# Altium project WiWi_SDR.PrjPcb (part 2 of 5)

## Sheet 06-SX1276.SchDoc
size B; SheetNumber: 6; SheetTotal: 19
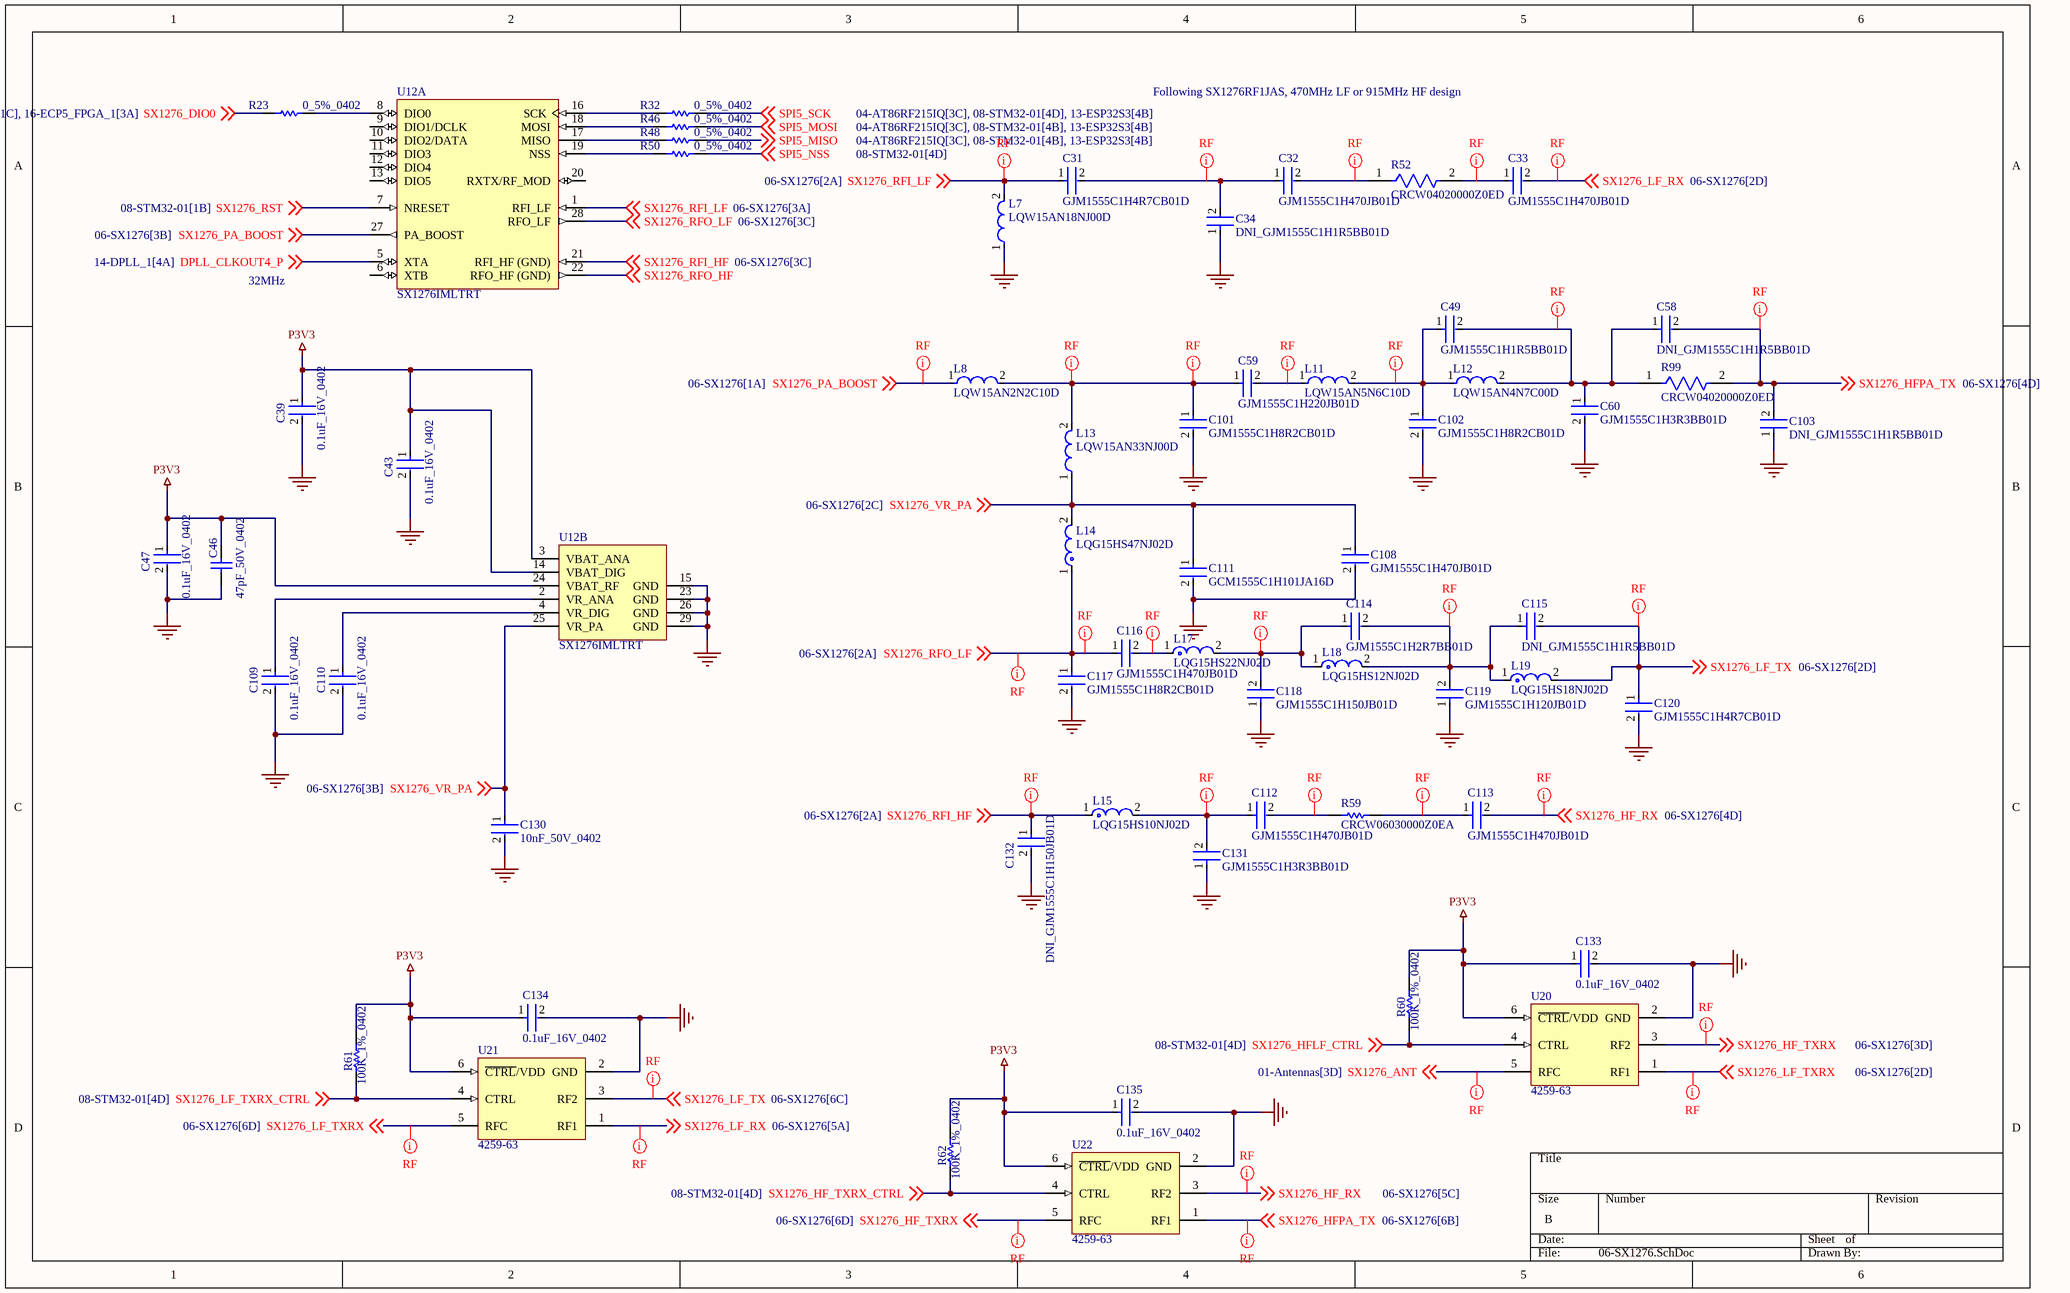
[diagram p4: 06-SX1276.SchDoc]

### Parts
C31  GJM1555C1H4R7CB01D  [FP-GJM155-0_05-IPC_B]
C32  GJM1555C1H470JB01D  [FP-GJM155-0_05-MFG]
C33  GJM1555C1H470JB01D  [FP-GJM155-0_05-MFG]
C34  DNI_GJM1555C1H1R5BB01D  [FP-GJM155-0_05-IPC_C]  (no BOM)
C39  0.1uF_16V_0402  [FP-C0402-BB-MFG]
C43  0.1uF_16V_0402  [FP-C0402-BB-MFG]
C46  47pF_50V_0402  [CAPC1005X55X25LL05T10]
C47  0.1uF_16V_0402  [FP-C0402-BB-MFG]
C49  GJM1555C1H1R5BB01D  [FP-GJM155-0_05-IPC_C]
C58  DNI_GJM1555C1H1R5BB01D  [FP-GJM155-0_05-IPC_C]  (no BOM)
C59  GJM1555C1H220JB01D  [FP-GJM155-0_05-IPC_C]
C60  GJM1555C1H3R3BB01D  [FP-GJM155-0_05-IPC_C]
C101  GJM1555C1H8R2CB01D  [FP-GJM155-0_05-IPC_C]
C102  GJM1555C1H8R2CB01D  [FP-GJM155-0_05-IPC_C]
C103  DNI_GJM1555C1H1R5BB01D  [FP-GJM155-0_05-IPC_C]  (no BOM)
C108  GJM1555C1H470JB01D  [FP-GJM155-0_05-MFG]
C109  0.1uF_16V_0402  [FP-C0402-BB-MFG]
C110  0.1uF_16V_0402  [FP-C0402-BB-MFG]
C111  GCM1555C1H101JA16D  [FP-GCM155-0_05-IPC_C]
C112  GJM1555C1H470JB01D  [FP-GJM155-0_05-MFG]
C113  GJM1555C1H470JB01D  [FP-GJM155-0_05-MFG]
C114  GJM1555C1H2R7BB01D  [FP-GJM155-0_05-IPC_A]
C115  DNI_GJM1555C1H1R5BB01D  [FP-GJM155-0_05-IPC_C]  (no BOM)
C116  GJM1555C1H470JB01D  [FP-GJM155-0_05-MFG]
C117  GJM1555C1H8R2CB01D  [FP-GJM155-0_05-IPC_C]
C118  GJM1555C1H150JB01D  [FP-GJM155-0_05-IPC_A]
C119  GJM1555C1H120JB01D  [FP-GJM155-0_05-IPC_A]
C120  GJM1555C1H4R7CB01D  [FP-GJM155-0_05-IPC_B]
C130  10nF_50V_0402  [FP-CL165-IPC_C]
C131  GJM1555C1H3R3BB01D  [FP-GJM155-0_05-IPC_C]
C132  DNI_GJM1555C1H150JB01D  [FP-GJM155-0_05-IPC_A]  (no BOM)
C133  0.1uF_16V_0402  [FP-C0402-BB-MFG]
C134  0.1uF_16V_0402  [FP-C0402-BB-MFG]
C135  0.1uF_16V_0402  [FP-C0402-BB-MFG]
L7  LQW15AN18NJ00D  [FP-LQW15AN_00-W0_6-0_1-MFG]
L8  LQW15AN2N2C10D  [FP-LQW15AN_00-W0_6-0_1-MFG]
L11  LQW15AN5N6C10D  [FP-LQW15AN_00-W0_6-0_1-MFG]
L12  LQW15AN4N7C00D  [FP-LQW15AN_00-W0_6-0_1-MFG]
L13  LQW15AN33NJ00D  [FP-LQW15AN_00-W0_5-0_1-MFG]
L14  LQG15HS47NJ02D  [FP-LQG15HH_02-IPC_B]
L15  LQG15HS10NJ02D  [FP-LQG15HH_02-IPC_A]
L17  LQG15HS22NJ02D  [FP-LQG15HH_02-MFG]
L18  LQG15HS12NJ02D  [FP-LQG15HH_02-IPC_A]
L19  LQG15HS18NJ02D  [FP-LQG15HH_02-MFG]
R23  0_5%_0402  [RESC1005X40X25NL05T10]
R32  0_5%_0402  [RESC1005X40X25NL05T10]
R46  0_5%_0402  [RESC1005X40X25NL05T10]
R48  0_5%_0402  [RESC1005X40X25NL05T10]
R50  0_5%_0402  [RESC1005X40X25NL05T10]
R52  CRCW04020000Z0ED  [FP-CRCW0402-e3-IPC_C]
R59  CRCW06030000Z0EA  [RESC1609X50X30NL8T20]
R60  100K_1%_0402  [RESC1005X40X25ML05T10]
R61  100K_1%_0402  [RESC1005X40X25ML05T10]
R62  100K_1%_0402  [RESC1005X40X25ML05T10]
R99  CRCW04020000Z0ED  [FP-CRCW0402-e3-IPC_C]
U12  SX1276IMLTRT  [SMTC-QFN-28_V]  (parts A,B of 2)
U20  4259-63  [PERE-SC-70-6_M]
U21  4259-63  [PERE-SC-70-6_M]
U22  4259-63  [PERE-SC-70-6_M]

### Nets
GND: C34.1 C39.2 C43.2 C46.1 C47.2 C60.2 C101.2 C102.2 C103.1 C108.2 C109.2 C110.2 C111.2 C117.2 C118.1 C119.1 C120.2 C130.2 C131.1 C132.2 C133.2 C134.2 C135.2 L7.1 U12.15(GND) U12.23(GND) U12.26(GND) U12.29(GND) U20.2(GND) U21.2(GND) U22.2(GND)
P3V3: C39.1 C43.1 C46.2 C47.1 C133.1 C134.1 C135.1 R60.2 R61.2 R62.2 U12.3(VBAT_ANA) U12.14(VBAT_DIG) U12.24(VBAT_RF) U20.6(~{CTRL}/VDD) U21.6(~{CTRL}/VDD) U22.6(~{CTRL}/VDD)
DPLL_CLKOUT4_P: U12.5(XTA) ; off-sheet DPLL_CLKOUT4_P
SPI5_MISO: R48.2 ; off-sheet SPI5_MISO
SPI5_MOSI: R46.2 ; off-sheet SPI5_MOSI
SPI5_NSS: R50.2 ; off-sheet SPI5_NSS
SPI5_SCK: R32.2 ; off-sheet SPI5_SCK
SX1276_ANT: U20.5(RFC) ; off-sheet SX1276_ANT
SX1276_DIO0: R23.1 ; off-sheet SX1276_DIO0
SX1276_HF_RX: C113.2 U22.3(RF2) ; off-sheet SX1276_HF_RX
SX1276_HF_TXRX: U20.3(RF2) U22.5(RFC) ; off-sheet SX1276_HF_TXRX
SX1276_HF_TXRX_CTRL: R62.1 U22.4(CTRL) ; off-sheet SX1276_HF_TXRX_CTRL
SX1276_HFLF_CTRL: R60.1 U20.4(CTRL) ; off-sheet SX1276_HFLF_CTRL
SX1276_HFPA_TX: C58.2 C103.2 R99.2 U22.1(RF1) ; off-sheet SX1276_HFPA_TX
SX1276_LF_RX: C33.2 U21.1(RF1) ; off-sheet SX1276_LF_RX
SX1276_LF_TX: C115.2 C120.1 L19.2 U21.3(RF2) ; off-sheet SX1276_LF_TX
SX1276_LF_TXRX: U20.1(RF1) U21.5(RFC) ; off-sheet SX1276_LF_TXRX
SX1276_LF_TXRX_CTRL: R61.1 U21.4(CTRL) ; off-sheet SX1276_LF_TXRX_CTRL
SX1276_PA_BOOST: L8.1 U12.27(PA_BOOST) ; off-sheet SX1276_PA_BOOST
SX1276_RFI_HF: C132.1 L15.1 U12.21(RFI_HF_(GND)) ; off-sheet SX1276_RFI_HF
SX1276_RFI_LF: C31.1 L7.2 U12.1(RFI_LF) ; off-sheet SX1276_RFI_LF
SX1276_RFO_HF: U12.22(RFO_HF_(GND)) ; off-sheet SX1276_RFO_HF
SX1276_RFO_LF: C116.1 C117.1 L14.1 U12.28(RFO_LF) ; off-sheet SX1276_RFO_LF
SX1276_RST: U12.7(NRESET) ; off-sheet SX1276_RST
SX1276_VR_PA: C108.1 C111.1 C130.1 L13.1 L14.2 U12.25(VR_PA) ; off-sheet SX1276_VR_PA
NetC31_2: C31.2 C32.1 C34.2
NetC32_2: C32.2 R52.1
NetC33_1: C33.1 R52.2
NetC49_1: C49.1 C102.1 L11.2 L12.1
NetC49_2: C49.2 C58.1 C60.1 L12.2 R99.1
NetC59_1: C59.1 C101.1 L8.2 L13.2
NetC59_2: C59.2 L11.1
NetC109_1: C109.1 U12.2(VR_ANA)
NetC110_1: C110.1 U12.4(VR_DIG)
NetC112_1: C112.1 C131.2 L15.2
NetC112_2: C112.2 R59.1
NetC113_1: C113.1 R59.2
NetC114_1: C114.1 C118.2 L17.2 L18.1
NetC114_2: C114.2 C115.1 C119.2 L18.2 L19.1
NetC116_2: C116.2 L17.1
NetR23_2: R23.2 U12.8(DIO0)
NetR32_1: R32.1 U12.16(SCK)
NetR46_1: R46.1 U12.18(MOSI)
NetR48_1: R48.1 U12.17(MISO)
NetR50_1: R50.1 U12.19(NSS)

Not connected (* = marked no-connect by the designer): U12 6(XTB) 9(DIO1/DCLK) 10(DIO2/DATA) 11(DIO3) 12(DIO4) 13(DIO5) 20(RXTX/RF_MOD)

### Layout directives
net class RF: NetC31_2, NetC32_2, NetC33_1, NetC49_1, NetC49_2, NetC59_1, NetC59_2, NetC112_1, NetC112_2, NetC113_1, NetC114_1, NetC114_2, NetC116_2, SX1276_ANT, SX1276_HF_RX, SX1276_HF_TXRX, SX1276_HFPA_TX, SX1276_LF_RX, SX1276_LF_TX, SX1276_LF_TXRX, SX1276_PA_BOOST, SX1276_RFI_HF, SX1276_RFI_LF, SX1276_RFO_LF

### Notes on the sheet
- Following SX1276RF1JAS, 470MHz LF or 915MHz HF design
- 32MHz

### Library data of the parts
C31 C120 = CMP-2008-03859-2: Multi-Layer Ceramic Capacitor 4.7pF C0G  ±0.25pF 0402 Paper T/R; Voltage Rating (DC): 50V; Temperature Coefficient: 30ppm/°C; Case/Package: 0402; Packaging: Tape and Reel; Package Quantity: 10000; Depth: 0.5mm; REACH SVHC: No SVHC; Height: 0.5mm; Lead Free: Lead Free; Number of Pins: 2; Case Code (Imperial): 0402; Width: 0.02inch; Max Operating Temperature: 125°C; Capacitance: 4.7pF; Dielectric: C0G; Lead Pitch: 0.3mm; Voltage Rating: 50V; Min Operating Temperature: -55°C; Thickness: 0.022inch; Voltage: 50V; Radiation Hardening: No; Mount: Surface Mount; Termination: SMD/SMT; Case Code (Metric): 1005; Length: 1mm
C32 C33 C108 C112 C113 C116 = CMP-06035-013708-1: Multi-Layer Ceramic Capacitor 47pF C0G  ±5% 0402 Paper T/R; Voltage Rating (DC): 50V; Capacitance: 47pF; Tolerance: 5%; Dielectric: C0G; Thickness: 500um; Length: 1mm; Width: 500um
C34 C49 C58 C103 C115 = CMP-2008-03820-2: Multi-Layer Ceramic Capacitor 1.5pF C0G  ±0.1pF 0402 Paper T/R; Temperature Coefficient: 30ppm/°C; Voltage Rating: 50V; Depth: 0.5mm; Case Code (Imperial): 0402; Package Quantity: 10000; Length: 1mm; Number of Pins: 2; Max Operating Temperature: 125°C; Mount: Surface Mount; Construction: Flat; Thickness: 0.022inch; Series: GJM; Packaging: Tape and Reel; Radiation Hardening: No; REACH SVHC: No SVHC; Case/Package: 0402; Lead Free: Lead Free; Voltage Rating (DC): 50V; Min Operating Temperature: -55°C; Dielectric: C0G; Termination: SMD/SMT; Width: 0.5mm; Capacitance: 1.5pF; Lead Pitch: 0.3mm; Case Code (Metric): 1005; Voltage: 50V; Height: 0.5mm
C39 C43 C47 C109 C110 C133-C135 = CMP-1034-02068-3: CAP CER 0.1UF 16V 5% X7R 0402; Manufacturer: Kemet; Manufacturer Part Number: C0402C104J4RACTU; Value: 0.10 μF; Temperature Coefficient: 15%; Tolerance: 0.05; Material: Ceramic; ComponentLink2URL: https://content.kemet.com/datasheets/KEM_C1002_X7R_SMD.pdf; Automotive: No; Device Class L2: Capacitors; Temperature: -55°C to +125°C; RoHS: TRUE; Voltage Rating: 16 V; ComponentLink2Description: Datasheet; Device Class L3: Ceramic Capacitors; Temperature Range Low: -55°C; Ipc Land Pattern Name: CAPC10050X50; Device Class L1: Passive Components; Temperature Range High: +125°C; Package: C0402-BB; Capacitance: 0.10 μF; Category: Cap; Mouser Description: CAP CER 0.1UF 16V X7R 0402; Height: 0.55mm; Digikey Description: CAP CER 0.1UF 16V 5% X7R 0402; Octopart: https://octopart.com/c0402c104j4ractu-kemet-12573893; Temperature Characteristic: X7R; Lead Free: Yes
C46 = CMP-2008-04368-1: Part Number: GRM1555C1H470JA01D; Manufacturer: Murata
C59 = CMP-06035-006261-1: Multi-Layer Ceramic Capacitor 22pF C0G  ±5% 0402 Paper T/R; Voltage Rating (DC): 50V; Length: 1mm; Width: 500um; Dielectric: C0G; Capacitance: 22pF; Thickness: 500um; Tolerance: 5%
C60 C131 = CMP-2008-03846-2: Multi-Layer Ceramic Capacitor 3.3pF C0G  ±0.1pF 0402 Paper T/R; Voltage: 50V; Lead Free: Lead Free; Thickness: 0.022inch; Mount: Surface Mount; Termination: SMD/SMT; Package Quantity: 1; Lead Pitch: 0.3mm; Case/Package: 0402; REACH SVHC: No SVHC; Case Code (Imperial): 0402; Number of Pins: 2; Height: 0.5mm; Width: 0.5mm; Depth: 0.5mm; Capacitance: 3.3pF; Packaging: Tape and Reel; Min Operating Temperature: -55°C; Length: 1mm; Dielectric: C0G; Case Code (Metric): 1005; Max Operating Temperature: 125°C; Voltage Rating (DC): 50V; Voltage Rating: 50V; Radiation Hardening: No
C101 C102 C117 = CMP-2008-03886-2: Multi-Layer Ceramic Capacitor 8.2pF C0G  ±0.25pF 0402 Paper T/R; Temperature Coefficient: 30ppm/°C; Voltage: 50V; Case Code (Metric): 1005; Max Operating Temperature: 125°C; Dielectric: C0G; Lead Free: Lead Free; Case/Package: 0402; Radiation Hardening: No; Length: 1mm; Thickness: 0.022inch; Case Code (Imperial): 0402; Number of Pins: 2; Depth: 0.5mm; Mount: Surface Mount; Termination: SMD/SMT; Voltage Rating (DC): 50V; Package Quantity: 1; Packaging: Tape and Reel; REACH SVHC: No SVHC; Min Operating Temperature: -55°C; Height: 0.5mm; Lead Pitch: 0.3mm; Capacitance: 8.2pF; Width: 0.5mm; Voltage Rating: 50V
C111 = CMP-2008-03694-3: Ceramic Capacitor for Automotive 100pF ±5% 50VDC C0G 0402 Paper T/R; Voltage: 50V; Ratings: AEC-Q200; Radiation Hardening: No; Min Operating Temperature: -55°C; Capacitance: 100pF; Depth: 0.5mm; Max Operating Temperature: 125°C; Length: 1mm; Height: 0.5mm; Termination: SMD/SMT; Voltage Rating: 50V; Dielectric: C0G; Package Quantity: 10000; Case Code (Imperial): 0402; Width: 0.02inch; Case/Package: 0402; Lead Free: Lead Free; Case Code (Metric): 1005; Voltage Rating (DC): 50V; Thickness: 0.022inch; Mount: Surface Mount; Tolerance: 5%; REACH SVHC: No SVHC; Weight: 0.000212oz; Packaging: Tape and Reel
C114 = CMP-2008-03840-2: Multi-Layer Ceramic Capacitor 2.7pF C0G  ±0.1pF 0402 Paper T/R; Voltage Rating (DC): 50V; Temperature Coefficient: 30ppm/°C; Max Operating Temperature: 125°C; Lead Free: Lead Free; REACH SVHC: No SVHC; Thickness: 0.022inch; Length: 1mm; Height: 0.5mm; Min Operating Temperature: -55°C; Mount: Surface Mount; Case/Package: 0402; Case Code (Imperial): 0402; Width: 0.02inch; Capacitance: 2.7pF; Packaging: Tape and Reel; Package Quantity: 10000; Lead Pitch: 0.3mm; Dielectric: C0G; Depth: 0.5mm; Voltage Rating: 50V; Radiation Hardening: No; Termination: SMD/SMT; Voltage: 50V; Number of Pins: 2; Case Code (Metric): 1005
C118 C132 = CMP-2008-03804-2: Multi-Layer Ceramic Capacitor 15pF C0G  ±5% 0402 Paper T/R; Voltage Rating (DC): 50V; Temperature Coefficient: 30ppm/°C; Dielectric: C0G; Max Operating Temperature: 125°C; Radiation Hardening: No; REACH SVHC: No SVHC; Case Code (Imperial): 0402; Package Quantity: 1; Thickness: 0.022inch; Min Operating Temperature: -55°C; Mount: Surface Mount; Tolerance: 5%; Voltage Rating: 50V; Depth: 0.5mm; Width: 0.02inch; Height: 0.5mm; Number of Pins: 2; Case Code (Metric): 1005; Lead Pitch: 0.3mm; Case/Package: 0402; Termination: SMD/SMT; Voltage: 50V; Length: 1mm; Capacitance: 15pF; Packaging: Tape and Reel; Lead Free: Lead Free
C119 = CMP-2008-03800-2: Multi-Layer Ceramic Capacitor 12pF C0G  ±5% 0402 Paper T/R; Voltage: 50V; Temperature Coefficient: 30ppm/°C; Tolerance: 5%; Package Quantity: 1; Dielectric: C0G; Height: 0.5mm; Voltage Rating: 50V; Radiation Hardening: No; Capacitance: 12pF; REACH SVHC: No SVHC; Voltage Rating (DC): 50V; Number of Pins: 2; Depth: 0.5mm; Mount: Surface Mount; Lead Free: Lead Free; Lead Pitch: 0.3mm; Width: 0.5mm; Min Operating Temperature: -55°C; Length: 1mm; Case/Package: 0402; Thickness: 0.022inch; Case Code (Metric): 1005; Packaging: Tape and Reel; Max Operating Temperature: 125°C; Case Code (Imperial): 0402; Termination: SMD/SMT
C130 = CMP-13271-000387-1: Cap Ceramic 10nF 50V X7R ±10% SMD 0402 +125°C Paper T/R; Depth: 0.5mm; Length: 1mm; Lead Free: Lead Free; Case Code (Metric): 1005; Width: 0.02inch; Min Operating Temperature: -55°C; Thickness: 0.022inch; Package Quantity: 1; Mount: Surface Mount; Height: 0.5mm; Voltage: 50V; Material: Ceramic; Tolerance: 10%; Case Code (Imperial): 0402; Radiation Hardening: No; Case/Package: 0402; Max Operating Temperature: 125°C; Voltage Rating (DC): 50V; Contact Plating: Tin; Packaging: Tape and Reel; Voltage Rating: 50V; Capacitance: 10nF; Dielectric: X7R
L7 = CMP-06042-006916-1: Wire Wound RF Inductor 18nH ±5% 370mA 0.27Ω 0402 (1005); Q Factor: 25; DC Resistance (DCR): 270mR; Test Frequency: 100MHz; Self Resonant Frequency: 4.5GHz; Core Material: Air; Shielding: Unshielded; Inductance: 18nH; Lead Free: Lead Free; Resistor Type: Wirewound; Height: 0.5mm; Width: 0.02inch; Max DC Current: 370mA; Case/Package: 0402; Radiation Hardening: No; Min Operating Temperature: -55°C; Packaging: Tape and Reel; DC Current: 370mA; Tolerance: 5%; Max Operating Temperature: 125°C; Weight: 2.8E-05oz; Current Rating: 370mA; Military Standard: Not; Termination: SMD/SMT; Length: 1mm; Case Code (Metric): 1005; Mount: Surface Mount; Case Code (Imperial): 0402; Package Quantity: 10000; Depth: 0.7mm
L8 = CMP-06042-008786-1: Wire Wound RF Inductor 2.2nH ±0.2nH 1000mA 0.027Ω 0402 (1005); Q Factor: 25; Current Rating: 1A; Core Material: Air; Test Frequency: 100MHz; Shielding: Unshielded; DC Resistance (DCR): 27mR; Self Resonant Frequency: 14GHz; Min Operating Temperature: -55°C; Package Quantity: 10000; Length: 1mm; Number of Pins: 2; Radiation Hardening: No; Case Code (Metric): 1005; Termination: SMD/SMT; Inductance: 2.2nH; Mount: Surface Mount; DC Current: 1A; Military Standard: Not; Max Operating Temperature: 125°C; Max DC Current: 1A; Lead Free: Lead Free; Depth: 0.7mm; Case/Package: 0402; Packaging: Tape and Reel; Height: 0.5mm; Width: 0.5mm; REACH SVHC: No SVHC; Weight: 2.8E-05oz; Case Code (Imperial): 0402
L11 = CMP-06042-014099-1: Wire Wound RF Inductor 5.6nH ±0.2nH 800mA 0.051Ω 0402 (1005); DC Resistance (DCR): 51mR; Self Resonant Frequency: 8GHz; Shielding: Unshielded; Core Material: Air; Q Factor: 30; Test Frequency: 100MHz; Depth: 0.7mm; Weight: 2.8E-05oz; Width: 0.5mm; Height: 0.5mm; DC Current: 800mA; Packaging: Tape and Reel; Max DC Current: 800mA; Case Code (Metric): 1005; Military Standard: Not; Case/Package: 0402; Inductance: 5.6nH; Package Quantity: 1; Termination: SMD/SMT; Resistor Type: Wirewound; Mount: Surface Mount; Lead Free: Lead Free; Min Operating Temperature: -55°C; Number of Pins: 2; REACH SVHC: No SVHC; Radiation Hardening: No; Length: 1mm; Current Rating: 800mA; Case Code (Imperial): 0402; Max Operating Temperature: 125°C
L12 = CMP-06042-000468-1: Wire Wound RF Inductor 4.7nH ±0.2nH 750mA 0.07Ω 0402 (1005); Q Factor: 25; Core Material: Air; Test Frequency: 100MHz; DC Resistance (DCR): 70mR; Self Resonant Frequency: 8GHz; Shielding: Unshielded; Packaging: Tape and Reel; Termination: SMD/SMT; Length: 1mm; Lead Free: Lead Free; Min Operating Temperature: -55°C; Height: 0.5mm; Military Standard: Not; Case Code (Metric): 1005; Width: 0.02inch; Inductance: 4.7nH; Case Code (Imperial): 0402; REACH SVHC: No SVHC; Weight: 2.8E-05oz; Current Rating: 750mA; Max Operating Temperature: 125°C; Number of Pins: 2; Package Quantity: 10000; Radiation Hardening: No; DC Current: 750mA; Max DC Current: 750mA; Case/Package: 0402; Depth: 0.7mm; Mount: Surface Mount
L13 = CMP-06042-007456-1: Wire Wound RF Inductor 33nH ±5% 260mA 0.63Ω 0402 (1005); Test Frequency: 100MHz; Core Material: Air; Shielding: Unshielded; Q Factor: 25; Self Resonant Frequency: 3.2GHz; DC Resistance (DCR): 630mR; Width: 0.5mm; Tolerance: 5%; Case Code (Imperial): 0402; Max Operating Temperature: 125°C; Inductance: 33nH; Weight: 2.8E-05oz; Case Code (Metric): 1005; Lead Free: Lead Free; Case/Package: 0402; Max DC Current: 260mA; Military Standard: Not; Length: 1mm; Packaging: Tape and Reel; Mount: Surface Mount; Package Quantity: 10000; Min Operating Temperature: -55°C; Resistor Type: Wirewound; Radiation Hardening: No; Height: 0.5mm; Termination: SMD/SMT; DC Current: 260mA; Current Rating: 260mA; Depth: 0.6mm
L14 = CMP-06042-015783-1: Multilayer type RF Inductor 47nH ±5% 0.72Ω 300mA 0402; Core Material: Air; DC Resistance (DCR): 720mR; DC Current: 200mA; Shielding: Unshielded; Self Resonant Frequency: 1GHz; Q Factor: 8; Test Frequency: 100MHz; Tolerance: 5%; Packaging: Tape and Reel; Case Code (Imperial): 0402; Max Operating Temperature: 125°C; Military Standard: Not; Length: 1mm; Radiation Hardening: No; Height: 0.5mm; Min Operating Temperature: -55°C; Width: 0.02inch; Inductance: 47nH; Lead Free: Lead Free; Termination: SMD/SMT; Height - Seated (Max): 0.022inch; Rated Current-Max: 200mA; Case/Package: 0402; Max DC Current: 200mA; Series: LQG15HS; Case Code (Metric): 1005; Mount: Surface Mount; Current Rating: 200mA; Depth: 0.55mm; Package Quantity: 1
L15 = CMP-06042-014117-1: Multilayer type RF Inductor 10nH ±5% 0.26Ω 500mA 0402; DC Resistance (DCR): 260mR; DC Current: 300mA; Shielding: Unshielded; Q Factor: 8; Test Frequency: 100MHz; Self Resonant Frequency: 3.4GHz; Core Material: Air; Width: 0.5mm; Radiation Hardening: No; Packaging: Tape and Reel; Lead Free: Lead Free; Military Standard: Not; Case/Package: 0402; Current Rating: 300mA; Case Code (Metric): 1005; Length: 0.039inch; Termination: SMD/SMT; Max DC Current: 300mA; Max Operating Temperature: 125°C; Mount: Surface Mount; Height - Seated (Max): 0.022inch; Package Quantity: 10000; Height: 0.5mm; Inductance: 10nH; Tolerance: 5%; Case Code (Imperial): 0402; Depth: 0.55mm; Min Operating Temperature: -55°C
L17 = CMP-06042-006776-1: Multilayer type RF Inductor 22nH ±5% 0.42Ω 350mA 0402; Current Rating: 300mA; Core Material: Air; Test Frequency: 100MHz; Self Resonant Frequency: 1.9GHz; Q Factor: 8; Shielding: Unshielded; DC Resistance (DCR): 420mR; Mount: Surface Mount; Lead Free: Lead Free; Military Standard: Not; Height - Seated (Max): 0.022inch; Case Code (Imperial): 0402; Length: 1mm; Max Operating Temperature: 125°C; Case/Package: 0402; Width: 0.02inch; Tolerance: 5%; Case Code (Metric): 1005; Min Operating Temperature: -55°C; Max DC Current: 300mA; Height: 0.5mm; Radiation Hardening: No; Depth: 0.55mm; Packaging: Tape and Reel; Termination: SMD/SMT; DC Current: 300mA; Inductance: 22nH; Package Quantity: 10000
L18 = CMP-2000-06576-2: Multilayer type RF Inductor 12nH ±5% 0.28Ω 500mA 0402; Self Resonant Frequency: 3GHz; Current Rating: 300mA; Core Material: Air; Shielding: Unshielded; Q Factor: 8; Test Frequency: 100MHz; DC Resistance (DCR): 280mR; Mount: Surface Mount; Width: 0.5mm; Tolerance: 5%; Lead Free: Lead Free; Max Operating Temperature: 125°C; Height - Seated (Max): 0.022inch; Case Code (Metric): 1005; Min Operating Temperature: -55°C; Depth: 0.55mm; Package Quantity: 10000; Case Code (Imperial): 0402; Termination: SMD/SMT; Max DC Current: 300mA; Radiation Hardening: No; Length: 0.039inch; Packaging: Tape and Reel; Inductance: 12nH; DC Current: 300mA; Weight: 2.3E-05oz; Case/Package: 0402; Military Standard: Not; Height: 0.5mm
L19 = CMP-06042-000668-1: Multilayer type RF Inductor 18nH ±5% 0.36Ω 400mA 0402; DC Current: 300mA; Test Frequency: 100MHz; Self Resonant Frequency: 2.2GHz; Shielding: Unshielded; Core Material: Air; DC Resistance (DCR): 360mR; Q Factor: 8; Inductance: 18nH; Military Standard: Not; REACH SVHC: No SVHC; Tolerance: 5%; Inductance Tolerance: 5%; Weight: 2.3E-05oz; Lead Free: Lead Free; Depth: 0.55mm; Current Rating: 300mA; Max DC Current: 300mA; Max Operating Temperature: 125°C; Length: 0.039inch; Min Operating Temperature: -55°C; Width: 0.5mm; Radiation Hardening: No; Termination: SMD/SMT; Height: 0.5mm; Package Quantity: 10000; Packaging: Tape and Reel; Case/Package: 0402; Case Code (Imperial): 0402; Mount: Surface Mount; Height - Seated (Max): 0.022inch; Case Code (Metric): 1005
R23 R32 R46 R48 R50 = CMP-2002-06457-1: Manufacturer: Panasonic; Part Number: ERJ-U020R00X
R52 R99 = CMP-2002-08122-2: RES Thick Film, 0Ω, 0.063W, 0402; Tolerance: 5%; Max Power Dissipation: 63mW; Voltage Rating: 50V; Temperature Coefficient: 100ppm/°C; Resistance: 0mR; Contact Plating: Tin; Height: 0.35mm; Radiation Hardening: No; Features: Automotive AEC-Q200; Composition: Thick Film; Width: 0.5mm; Weight: 2.3E-05oz; Termination: SMD/SMT; Packaging: Tape and Reel; Mount: Surface Mount; Case Code (Metric): 1005; Military Standard: Not; Min Operating Temperature: -55°C; Number of Terminations: 2; Package Quantity: 1; Case Code (Imperial): 0402; Depth: 0.5mm; Max Operating Temperature: 155°C; Case/Package: 0402; Power Rating: 63mW; Lead Free: Lead Free; Voltage Rating (DC): 50V; Length: 1mm
R59 = CMP-2000-03816-5: Chip Resistor, 0 Ohm, Jumper, 100 mW, -55 to 155 degC, 0603 (1608 Metric), RoHS, Tape and Reel; Manufacturer: Vishay Semiconductor; Voltage Rating: 75 V; Package Quantity: 5000; DatasheetVersion: 06/2012; Min Operating Temperature: -55 degC; ComponentLink1URL: http://www.vishay.com/; Mounting Technology: Surface Mount; Height: 0.45 mm; ComponentLink1Description: Manufacturer URL; REACH SVHC: Unknown; PackageReference: 0603; Packaging: Tape and Reel; Max Operating Temperature: 155 degC; Mount: Surface Mount; ComponentLink2Description: Datasheet; PackageDescription: 2-Pin Surface Mount Device, Body 1.575 x 0.85 mm; Length: 1.55 mm; ComponentLink2URL: http://www.vishay.com/docs/20035/dcrcwe3.pdf; Pins: 2; RoHSCompliant: true
R60-R62 = CMP-2002-07852-1: Manufacturer: Yageo; Part Number: RC0402FR-13100KL
U12 = CMP-2000-05356-1: Low Power Long Range Transceiver, 137 to 1020 MHz, -40 to 85 degC, 28-Pin QFN, RoHS, Tape and Reel; Manufacturer: Semtech; Power - Output: 20dBm; Data Rate (Max): 300kbps; Sensitivity: -148dBm; Featured Product: SX1276LongRangeTransceiver; PCN Design/Specification: CopperWire25/Mar/2014; GPIO: 6; Frequency: 137MHz~1.02GHz; Voltage - Supply: 1.8V~3.7V; Protocol: LoRa™; Current - Transmitting: 20mA~120mA; Current - Receiving: 10.8mA~12mA; Online Catalog: SX1276,SX1277andSX1278; Design Resources: SX127xReferenceDesignOverviewDevelopmentToolSelector; Serial Interfaces: SPI; Mfg Application Notes: LoRaModulation:CrystalOscillatorGuidanceSX12xxSoftwareImplementationofDataWhiteningandCRCSX127xLoRaLowEnergyDesignGuideSX127xLoRaModemDesignersGuide; Modulation: FSK,GFSK,GMSK,MSK,OOK; Other Names: SX1276IMLTRTTR; Series: -; Manufacturer URL: http://www.semtech.com/; Datasheet URL: http://www.semtech.com/images/datasheet/sx1276.pdf; Type: TxRx+MCU; RF Family/Standard: 802.15.4; Package Reference: QFN-28; Standard Package: 3,000; Package Description: 28-Pin Quad Flat No-lead Package, Body 6 x 6 mm, Pitch 0.65 mm; Category: RF/IFandRFID; Operating Temperature: -40degC~85degC; Datasheet Version: Rev. 4, 03/2015; Memory Size: -; Family: RFTransceiverICs; Packaging: Tape&Reel(TR); Package / Case: 28-VQFNExposedPad
U20-U22 = CMP-2000-05298-1: IC RF Switch SPDT, 50 Ohm, 6-Pin SC70, RoHS, Tape and Reel; Manufacturer: Peregrine Semiconductor; P1dB: 29dBm(typ)IP1dB; Topology: Reflective; Frequency - Upper: 3GHz; Insertion Loss @ Frequency: 0.5dB@2GHz; IIP3: 55dBm(typ); Voltage - Supply: 1.8V~3.3V; Other Names: 1046-1011-24259-63-ND425963PE4259PE4259SCBC-ZPE4259SCBC-Z-ND; Isolation @ Frequency: 20dB@2GHz(typ); Frequency - Lower: 10MHz; Online Catalog: PE4259; Impedance: 50Ohm; RF Type: GeneralPurpose; Series: UltraCMOS; Manufacturer URL: http://www.psemi.com/; Package Description: 6-Pin Small Outline Transistor, Body 2.05 x 1.25 mm, Pitch 0.65 mm; Family: RFSwitches; Packaging: Tape&Reel(TR); Features: Single/DualLineControl; Package / Case: 6-TSSOP,SC-88,SOT-363; Operating Temperature: -40degC~85degC; Circuit: SPDT; Supplier Device Package: SC-70-6; Standard Package: 3,000; Datasheet URL: https://datasheet.ciiva.com/15100/getdatasheetpartid-685660-15100501.pdf; Category: RF/IFandRFID; Datasheet Version: Jan-11; Package Reference: SC-70-6

## Sheet 07-TCXO_Crystal.SchDoc
size B; SheetNumber: 6; SheetTotal: 16
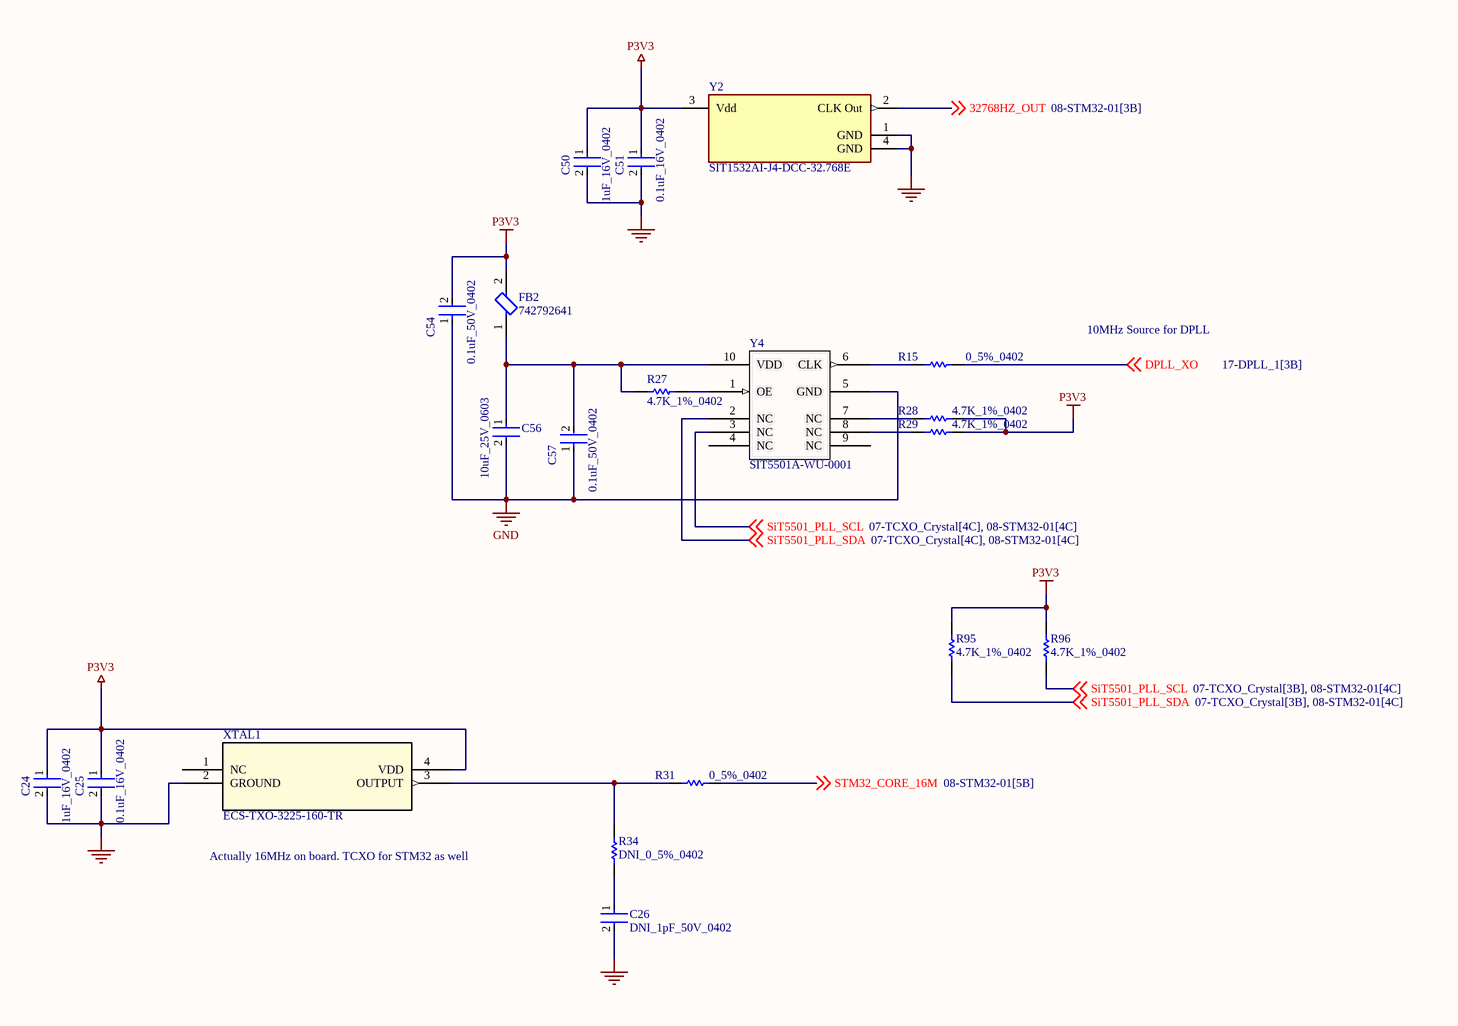
[diagram p5: 07-TCXO_Crystal.SchDoc]

### Parts
C24  1uF_16V_0402  [FP-0402-L_1_0_0_05-W_0_5-IPC_A]
C25  0.1uF_16V_0402  [FP-C0402-BB-MFG]
C26  DNI_1pF_50V_0402  [FP-GJM155-0_05-IPC_B]  (no BOM)
C50  1uF_16V_0402  [FP-0402-L_1_0_0_05-W_0_5-IPC_A]
C51  0.1uF_16V_0402  [FP-C0402-BB-MFG]
C54  0.1uF_50V_0402  [FP-C1005-050-0_05-IPC_C]
C56  10uF_25V_0603  [FP-CL10-IPC_C]
C57  0.1uF_50V_0402  [FP-C1005-050-0_05-IPC_C]
FB2  742792641  [FP-742792641-MFG]
R15  0_5%_0402  [RESC1005X40X25NL05T10]
R27  4.7K_1%_0402  [RESC1005X40X25NL10T10]
R28  4.7K_1%_0402  [RESC1005X40X25NL10T10]
R29  4.7K_1%_0402  [RESC1005X40X25NL10T10]
R31  0_5%_0402  [RESC1005X40X25NL05T10]
R34  DNI_0_5%_0402  [RESC1005X40X25NL05T10]  (no BOM)
R95  4.7K_1%_0402  [RESC1005X40X25NL10T10]
R96  4.7K_1%_0402  [RESC1005X40X25NL10T10]
XTAL1  ECS-TXO-3225-160-TR  [ECS-TXO-3225_ECS]
Y2  SIT1532AI-J4-DCC-32.768E  [FP-SIT1532-MFG]
Y4  SIT5501A-WU-0001  [SITIME_SPL-086-CQFN-010-C07050_REV_DRAFT]

### Nets
GND: C24.2 C25.2 C26.2 C50.2 C51.2 C54.1 C56.2 C57.1 XTAL1.2(GROUND) Y2.1(GND) Y2.4(GND) Y4.5(GND)
P3V3: C24.1 C25.1 C50.1 C51.1 C54.2 FB2.2 R28.2 R29.2 R95.2 R96.2 XTAL1.4(VDD) Y2.3(Vdd)
32768HZ_OUT: Y2.2(CLK_Out) ; off-sheet 32768HZ_OUT
DPLL_XO: R15.2 ; off-sheet DPLL_XO
SiT5501_PLL_SCL: R96.1 Y4.3(NC) ; off-sheet SiT5501_PLL_SCL
SiT5501_PLL_SDA: R95.1 Y4.2(NC) ; off-sheet SiT5501_PLL_SDA
STM32_CORE_16M: R31.2 ; off-sheet STM32_CORE_16M
NetC26_1: C26.1 R34.1
NetC56_1: C56.1 C57.2 FB2.1 R27.1 Y4.10(VDD)
NetR15_1: R15.1 Y4.6(CLK)
NetR27_2: R27.2 Y4.1(OE)
NetR28_1: R28.1 Y4.7(NC)
NetR29_1: R29.1 Y4.8(NC)
NetR31_1: R31.1 R34.2 XTAL1.3(OUTPUT)

Not connected (* = marked no-connect by the designer): XTAL1 1(NC); Y4 4(NC) 9(NC)

### Notes on the sheet
- 10MHz Source for DPLL
- Actually 16MHz on board. TCXO for STM32 as well

### Library data of the parts
C24 C50 = CMP-14477-000104-2: None; Tolerance: 10%; Voltage Rating: 16V; Dielectric: X5R; Capacitance: 1uF; Packaging: Tape and Reel; Depth: 0.5mm; Mount: Surface Mount; Thickness: 0.022inch; Package Quantity: 1; Min Operating Temperature: -55°C; Series: M; Voltage Rating (DC): 16V; Termination: SMD/SMT; Case/Package: 0402; Number of Pins: 2; Case Code (Imperial): 0402; Length: 1mm; Halogen Free: Halogen Free; Case Code (Metric): 1005; Width: 0.02inch; RoHS Compliant: Yes; Radiation Hardening: No; Max Operating Temperature: 85°C; Height: 0.5mm; Construction: Flat
C25 C51 = CMP-1034-02068-3: as C39 on sheet 06-SX1276; ComponentLink2URL: https://content.kemet.com/datasheets/KEM_C1002_X7R_SMD.pdf; Automotive: No; Device Class L2: Capacitors; Temperature: -55°C to +125°C; RoHS: TRUE; Voltage Rating: 16 V; ComponentLink2Description: Datasheet; Device Class L3: Ceramic Capacitors; Temperature Range Low: -55°C; Ipc Land Pattern Name: CAPC10050X50; Device Class L1: Passive Components; Temperature Range High: +125°C; Package: C0402-BB; Capacitance: 0.10 μF; Category: Cap; Mouser Description: CAP CER 0.1UF 16V X7R 0402; Height: 0.55mm; Digikey Description: CAP CER 0.1UF 16V 5% X7R 0402; Octopart: https://octopart.com/c0402c104j4ractu-kemet-12573893; Temperature Characteristic: X7R; Lead Free: Yes
C26 = CMP-2008-03808-2: Multi-Layer Ceramic Capacitor 1pF C0G  ±0.1pF 0402 Paper T/R; Temperature Coefficient: 30ppm/°C; Voltage Rating (DC): 50V; REACH SVHC: No SVHC; Packaging: Tape and Reel; Width: 0.02inch; Package Quantity: 10000; Min Operating Temperature: -55°C; Case Code (Imperial): 0402; Lead Pitch: 0.3mm; Capacitance: 1pF; Length: 1mm; Max Operating Temperature: 125°C; Depth: 0.5mm; Thickness: 0.022inch; Case Code (Metric): 1005; Lead Free: Lead Free; Voltage: 50V; Mount: Surface Mount; Number of Pins: 2; Termination: SMD/SMT; Radiation Hardening: No; Dielectric: C0G; Case/Package: 0402; Voltage Rating: 50V; Height: 0.5mm
C54 C57 = CMP-2000-05393-2: Multilayer Ceramic Capacitors 100nF ±10% 50V X7R SMD 0402; Voltage: 50V; Dielectric Material: Ceramic; Min Operating Temperature: -55°C; Depth: 0.5mm; Radiation Hardening: No; RoHS Compliant: Yes; Voltage Rating (DC): 50V; Lead Free: Lead Free; Resistor Type: Ceramic; Height: 0.5mm; Dielectric: X7R; Thickness: 0.022inch; Case/Package: 0402; Case Code (Metric): 1005; Termination: SMD/SMT; Capacitance: 100nF; Packaging: Tape and Reel; Max Operating Temperature: 125°C; Mount: Surface Mount; Package Quantity: 1; Width: 0.02inch; Weight: 2.3E-05oz; Voltage Rating: 50V; Tolerance: 10%; Construction: Flat; Case Code (Imperial): 0402; Length: 1mm; REACH SVHC: No SVHC; Series: C
C56 = CMP-13271-004224-1: Cap Ceramic 10uF 25V X5R ±20% Pad SMD 0603 +85°C T/R; Width: 0.031inch; Voltage Rating: 25V; Length: 0.063inch; Case Code (Metric): 1608; Dielectric: X5R; Termination: Wraparound; Capacitance: 10uF; Lead Free: Lead Free; Mount: Surface Mount; Package Quantity: 1; Case Code (Imperial): 0603; Thickness: 0.035inch; Packaging: Tape and Reel; Contact Plating: Tin; Min Operating Temperature: -55°C; Tolerance: 20%; Max Operating Temperature: 85°C; Case/Package: 0603
FB2 = CMP-0220-00171-2: FERRITE BEAD 300 OHM 0603 1LN; Inductance: 18nH; Max DC Current: 2A; Number of Lines: 1; Test Frequency: 100MHz; Impedance: 300R; DC Resistance (DCR): 150mR; Tolerance: 25%; Case Code (Metric): 1608; Core Material: Ferrite; Length: 1.6mm; Lead Free: Lead Free; Series: WE-CBF; Min Operating Temperature: -55°C; RoHS Compliant: Yes; Case/Package: SMD/SMT; Material: Ferrite; Max Operating Temperature: 125°C; Termination: SMD/SMT; Packaging: Tape and Reel; Weight: 0.000141oz; Case Code (Imperial): 0603; Width: 0.8mm; Mount: Surface Mount; Max Current Rating: 2A; Package Quantity: 1; Depth: 0.8mm; Current Rating: 2A; Height: 0.8mm
R15 R31 R34 = CMP-2002-06457-1: as R23 on sheet 06-SX1276
R27-R29 R95 R96 = CMP-2002-05217-1: Manufacturer: Bourns; Part Number: CR0402-FX-4701GLF
XTAL1 = ECS-TXO-3225-122.8-TR: No Description Available; Mfr_Name: ECS International; RefDes: RefDes; Type: Type; Supplier 1: Newark; Supplier Part Number 1: 54AK5779
Y2 = CMP-25159-261190-1: MEMS OSC XO 32.7680KHZ LVCMOS; Max Supply Voltage: 3.63V; Current Rating: 1.35uA; Frequency Stability: 100ppm; Frequency: 32.768kHz; Max Supply Current: 1.4uA; Load Capacitance: 10pF; Max Duty Cycle: 52%; Min Supply Voltage: 1.5V; Length: 1.5mm; Max Operating Temperature: 85°C; Packaging: Tape and Reel; Termination: SMD/SMT; Min Operating Temperature: -40°C; RoHS Compliant: Yes; Width: 0.8mm; Package Quantity: 1000; Lead Free: Lead Free; Mount: Surface Mount; Height: 0.6mm; Series: SiT1532
Y4 = CMP-OSC-00029-2: OSC, MEMS, STRATUM 3E, 10.000MHZ, 10PPB STAB, LVCMOS, 3.3V, O/P EN, 7.0X5.0X2.2MM, CQFN-10; Manufacturer: SiTime; Frequency: 10 MHz; Voltage - Supply: 3.3 V; Type: OCXO; Category: Oscillators; Max Operating Temperature: 70°C; Manufacturer Part Number: SIT5501A-WU-0001; Min Operating Temperature: -20°C; Height: 2.20mm (max); Case/Package: 10 Lead QFN; Output: LVCMOS; Mounting Type: Surface Mount; Frequency Stability: ±10 ppb; RoHS: Yes

## Sheet 08-STM32-01.SchDoc
size B; SheetNumber: 8; SheetTotal: 19
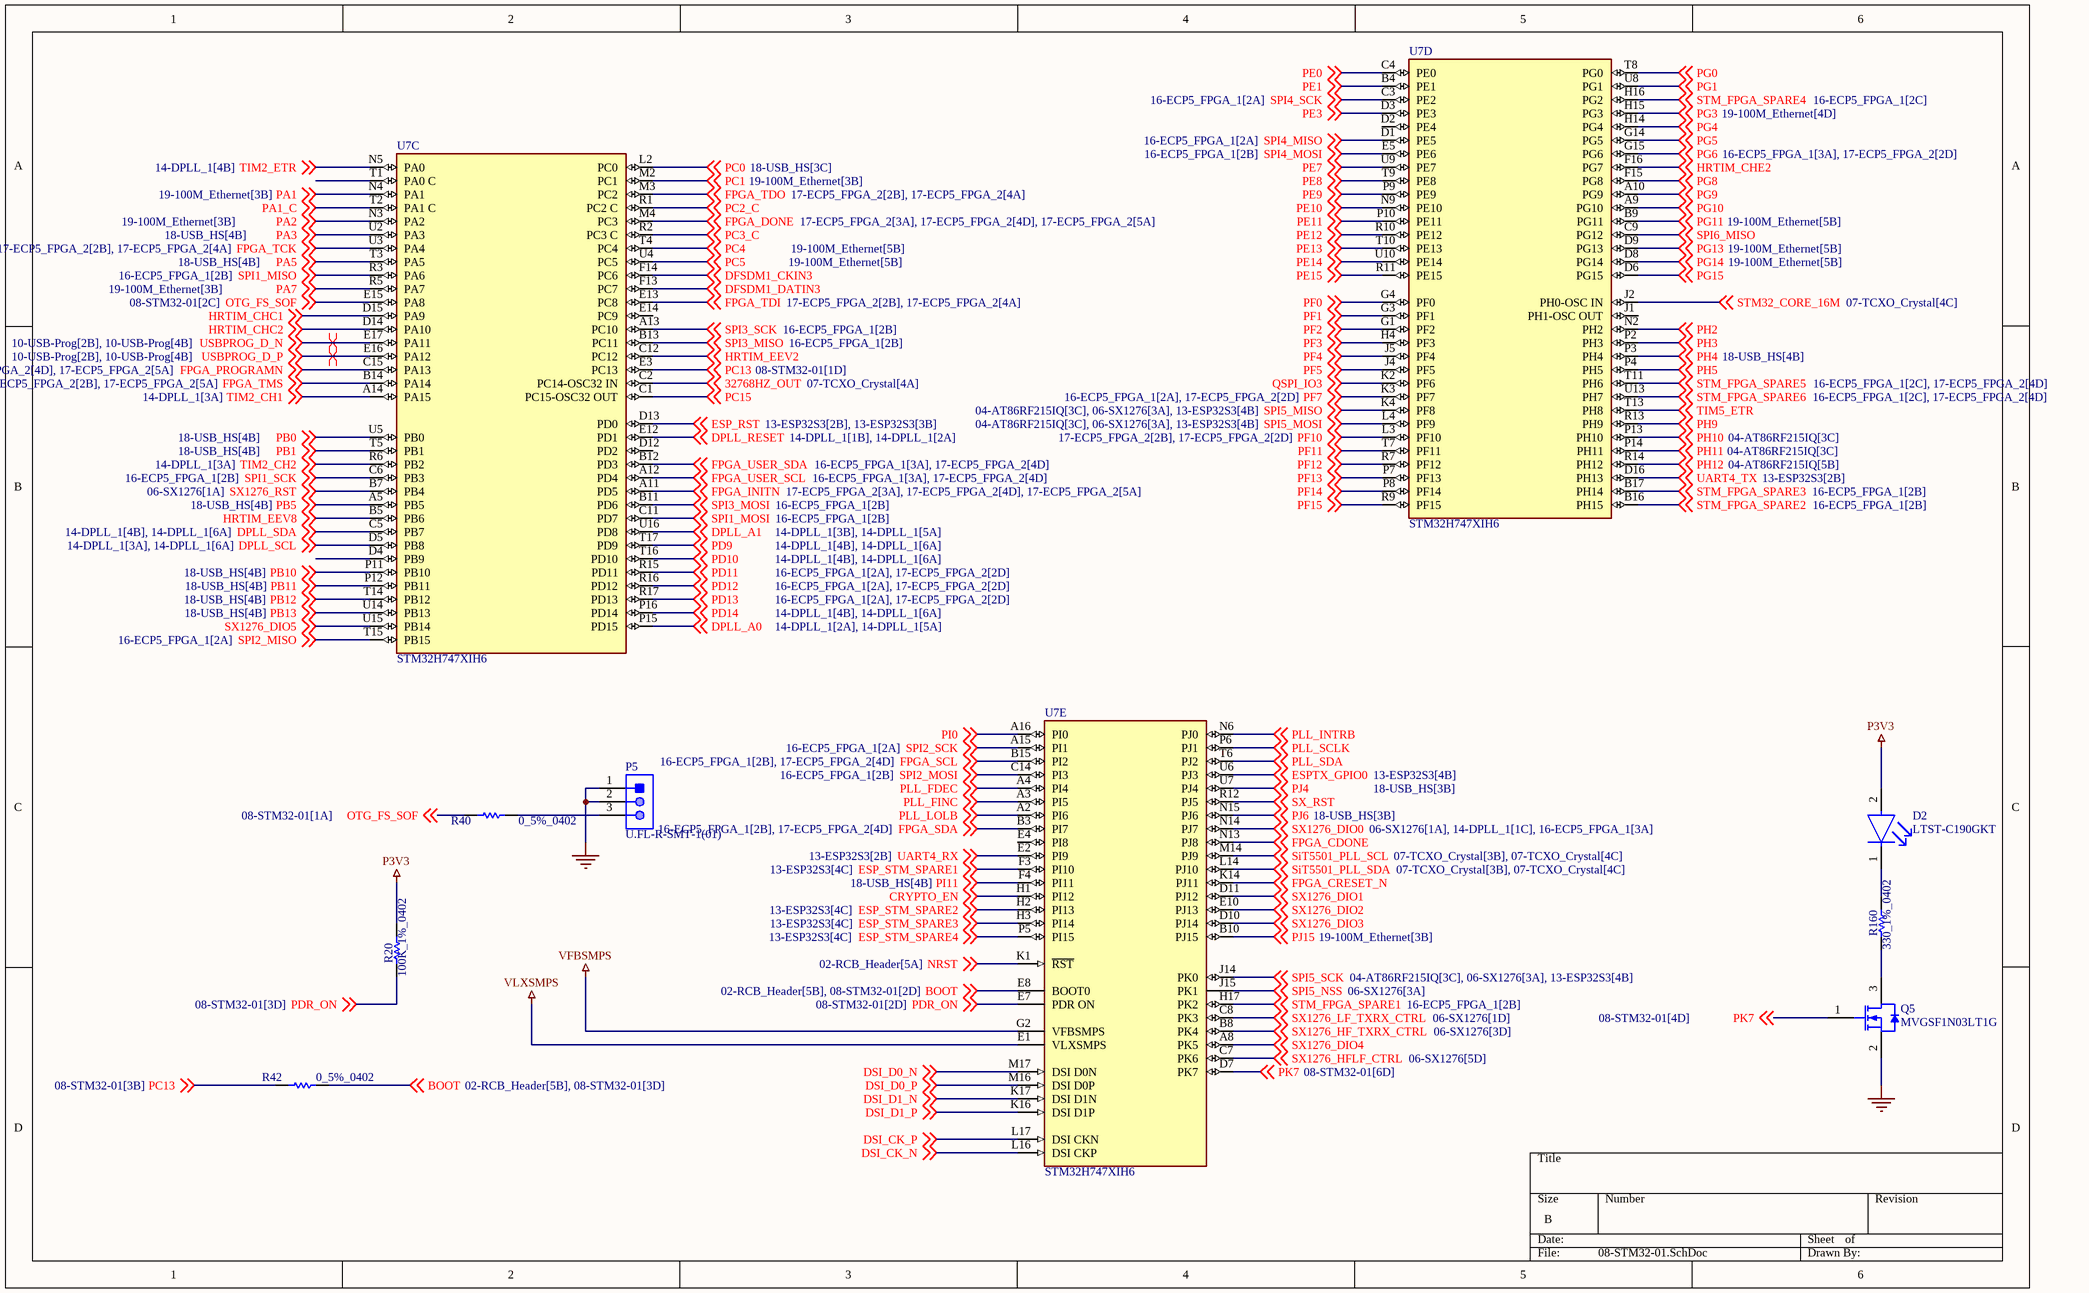
[diagram p6: 08-STM32-01.SchDoc]

### Parts
D2  LTST-C190GKT  [FP-LTST-C190GKT-MFG]
P5  U.FL-R-SMT-1(01)  [HRS-U.FL-R-SMT-3_V]
Q5  MVGSF1N03LT1G  [ONSC-SOT-23-3-318-08_V]
R20  100K_1%_0402  [RESC1005X40X25ML05T10]
R40  0_5%_0402  [RESC1005X40X25NL05T10]
R42  0_5%_0402  [RESC1005X40X25NL05T10]
R160  330_1%_0402  [RESC1005X40X25NL10T10]
U7  STM32H747XIH6  [FP-TFBGA240+25-A07U-MFG]  (parts C,D,E of 5)

### Nets
GND: P5.1 P5.2 Q5.2(S)
P3V3: D2.2(A) R20.2
VFBSMPS: U7.G2(VFBSMPS)
VLXSMPS: U7.E1(VLXSMPS)
32768HZ_OUT: U7.C2(PC14-OSC32_IN) ; off-sheet 32768HZ_OUT
BOOT: R42.2 U7.E8(BOOT0) ; off-sheet BOOT
CRYPTO_EN: U7.H1(PI12) ; off-sheet CRYPTO_EN
DFSDM1_CKIN3: U7.F14(PC6) ; off-sheet DFSDM1_CKIN3
DFSDM1_DATIN3: U7.F13(PC7) ; off-sheet DFSDM1_DATIN3
DPLL_A0: U7.P15(PD15) ; off-sheet DPLL_A0
DPLL_A1: U7.U16(PD8) ; off-sheet DPLL_A1
DPLL_RESET: U7.E12(PD1) ; off-sheet DPLL_RESET
DPLL_SCL: U7.D5(PB8) ; off-sheet DPLL_SCL
DPLL_SDA: U7.C5(PB7) ; off-sheet DPLL_SDA
DSI_CK_N: U7.L16(DSI_CKP) ; off-sheet DSI_CK_N
DSI_CK_P: U7.L17(DSI_CKN) ; off-sheet DSI_CK_P
DSI_D0_N: U7.M17(DSI_D0N) ; off-sheet DSI_D0_N
DSI_D0_P: U7.M16(DSI_D0P) ; off-sheet DSI_D0_P
DSI_D1_N: U7.K17(DSI_D1N) ; off-sheet DSI_D1_N
DSI_D1_P: U7.K16(DSI_D1P) ; off-sheet DSI_D1_P
ESP_RST: U7.D13(PD0) ; off-sheet ESP_RST  [project net ESPTX_RST]
ESP_STM_SPARE1: U7.F3(PI10) ; off-sheet ESP_STM_SPARE1
ESP_STM_SPARE2: U7.H2(PI13) ; off-sheet ESP_STM_SPARE2
ESP_STM_SPARE3: U7.H3(PI14) ; off-sheet ESP_STM_SPARE3
ESP_STM_SPARE4: U7.P5(PI15) ; off-sheet ESP_STM_SPARE4
ESPTX_GPIO0: U7.U6(PJ3) ; off-sheet ESPTX_GPIO0
FPGA_CDONE: U7.N13(PJ8) ; off-sheet FPGA_CDONE
FPGA_CRESET_N: U7.K14(PJ11) ; off-sheet FPGA_CRESET_N
FPGA_DONE: U7.M4(PC3) ; off-sheet FPGA_DONE
FPGA_INITN: U7.A11(PD5) ; off-sheet FPGA_INITN
FPGA_PROGRAMN: U7.C15(PA13) ; off-sheet FPGA_PROGRAMN
FPGA_SCL: U7.B15(PI2) ; off-sheet FPGA_SCL
FPGA_SDA: U7.B3(PI7) ; off-sheet FPGA_SDA
FPGA_TCK: U7.U3(PA4) ; off-sheet FPGA_TCK
FPGA_TDI: U7.E13(PC8) ; off-sheet FPGA_TDI
FPGA_TDO: U7.M3(PC2) ; off-sheet FPGA_TDO
FPGA_TMS: U7.B14(PA14) ; off-sheet FPGA_TMS
FPGA_USER_SCL: U7.A12(PD4) ; off-sheet FPGA_USER_SCL
FPGA_USER_SDA: U7.B12(PD3) ; off-sheet FPGA_USER_SDA
HRTIM_CHC1: U7.D15(PA9) ; off-sheet HRTIM_CHC1
HRTIM_CHC2: U7.D14(PA10) ; off-sheet HRTIM_CHC2
HRTIM_CHE2: U7.F16(PG7) ; off-sheet HRTIM_CHE2
HRTIM_EEV2: U7.C12(PC12) ; off-sheet HRTIM_EEV2
HRTIM_EEV8: U7.B5(PB6) ; off-sheet HRTIM_EEV8
NRST: U7.K1(~{RST}) ; off-sheet NRST
OTG_FS_SOF: R40.1 U7.E15(PA8) ; off-sheet OTG_FS_SOF
PA1: U7.N4(PA1) ; off-sheet PA1
PA1_C: U7.T2(PA1_C) ; off-sheet PA1_C
PA2: U7.N3(PA2) ; off-sheet PA2
PA3: U7.U2(PA3) ; off-sheet PA3
PA5: U7.T3(PA5) ; off-sheet PA5
PA7: U7.R5(PA7) ; off-sheet PA7
PB0: U7.U5(PB0) ; off-sheet PB0
PB1: U7.T5(PB1) ; off-sheet PB1
PB5: U7.A5(PB5) ; off-sheet PB5
PB10: U7.P11(PB10) ; off-sheet PB10
PB11: U7.P12(PB11) ; off-sheet PB11
PB12: U7.T14(PB12) ; off-sheet PB12
PB13: U7.U14(PB13) ; off-sheet PB13
PC0: U7.L2(PC0) ; off-sheet PC0
PC1: U7.M2(PC1) ; off-sheet PC1
PC2_C: U7.R1(PC2_C) ; off-sheet PC2_C
PC3_C: U7.R2(PC3_C) ; off-sheet PC3_C
PC4: U7.T4(PC4) ; off-sheet PC4
PC5: U7.U4(PC5) ; off-sheet PC5
PC13: R42.1 U7.E3(PC13) ; off-sheet PC13
PC15: U7.C1(PC15-OSC32_OUT) ; off-sheet PC15
PD9: U7.T17(PD9) ; off-sheet PD9
PD10: U7.T16(PD10) ; off-sheet PD10
PD11: U7.R15(PD11) ; off-sheet PD11
PD12: U7.R16(PD12) ; off-sheet PD12
PD13: U7.R17(PD13) ; off-sheet PD13
PD14: U7.P16(PD14) ; off-sheet PD14
PDR_ON: R20.1 U7.E7(PDR_ON) ; off-sheet PDR_ON
PE0: U7.C4(PE0) ; off-sheet PE0
PE1: U7.B4(PE1) ; off-sheet PE1
PE3: U7.D3(PE3) ; off-sheet PE3
PE7: U7.U9(PE7) ; off-sheet PE7
PE8: U7.T9(PE8) ; off-sheet PE8
PE9: U7.P9(PE9) ; off-sheet PE9
PE10: U7.N9(PE10) ; off-sheet PE10
PE11: U7.P10(PE11) ; off-sheet PE11
PE12: U7.R10(PE12) ; off-sheet PE12
PE13: U7.T10(PE13) ; off-sheet PE13
PE14: U7.U10(PE14) ; off-sheet PE14
PE15: U7.R11(PE15) ; off-sheet PE15
PF0: U7.G4(PF0) ; off-sheet PF0
PF1: U7.G3(PF1) ; off-sheet PF1
PF2: U7.G1(PF2) ; off-sheet PF2
PF3: U7.H4(PF3) ; off-sheet PF3
PF4: U7.J5(PF4) ; off-sheet PF4
PF5: U7.J4(PF5) ; off-sheet PF5
PF7: U7.K3(PF7) ; off-sheet PF7
PF10: U7.L3(PF10) ; off-sheet PF10
PF11: U7.T7(PF11) ; off-sheet PF11
PF12: U7.R7(PF12) ; off-sheet PF12
PF13: U7.P7(PF13) ; off-sheet PF13
PF14: U7.P8(PF14) ; off-sheet PF14
PF15: U7.R9(PF15) ; off-sheet PF15
PG0: U7.T8(PG0) ; off-sheet PG0
PG1: U7.U8(PG1) ; off-sheet PG1
PG3: U7.H15(PG3) ; off-sheet PG3
PG4: U7.H14(PG4) ; off-sheet PG4
PG5: U7.G14(PG5) ; off-sheet PG5
PG6: U7.G15(PG6) ; off-sheet PG6
PG8: U7.F15(PG8) ; off-sheet PG8
PG9: U7.A10(PG9) ; off-sheet PG9
PG10: U7.A9(PG10) ; off-sheet PG10
PG11: U7.B9(PG11) ; off-sheet PG11
PG13: U7.D9(PG13) ; off-sheet PG13
PG14: U7.D8(PG14) ; off-sheet PG14
PG15: U7.D6(PG15) ; off-sheet PG15
PH2: U7.N2(PH2) ; off-sheet PH2
PH3: U7.P2(PH3) ; off-sheet PH3
PH4: U7.P3(PH4) ; off-sheet PH4
PH5: U7.P4(PH5) ; off-sheet PH5
PH9: U7.R13(PH9) ; off-sheet PH9
PH10: U7.P13(PH10) ; off-sheet PH10
PH11: U7.P14(PH11) ; off-sheet PH11
PH12: U7.R14(PH12) ; off-sheet PH12
PI0: U7.A16(PI0) ; off-sheet PI0
PI11: U7.F4(PI11) ; off-sheet PI11
PJ4: U7.U7(PJ4) ; off-sheet PJ4
PJ6: U7.N15(PJ6) ; off-sheet PJ6
PJ15: U7.B10(PJ15) ; off-sheet PJ15
PK7: Q5.1(G) U7.D7(PK7) ; off-sheet PK7
PLL_FDEC: U7.A4(PI4) ; off-sheet PLL_FDEC
PLL_FINC: U7.A3(PI5) ; off-sheet PLL_FINC
PLL_INTRB: U7.N6(PJ0) ; off-sheet PLL_INTRB
PLL_LOLB: U7.A2(PI6) ; off-sheet PLL_LOLB
PLL_SCLK: U7.P6(PJ1) ; off-sheet PLL_SCLK
PLL_SDA: U7.T6(PJ2) ; off-sheet PLL_SDA
QSPI_IO3: U7.K2(PF6) ; off-sheet QSPI_IO3
SiT5501_PLL_SCL: U7.M14(PJ9) ; off-sheet SiT5501_PLL_SCL
SiT5501_PLL_SDA: U7.L14(PJ10) ; off-sheet SiT5501_PLL_SDA
SPI1_MISO: U7.R3(PA6) ; off-sheet SPI1_MISO
SPI1_MOSI: U7.C11(PD7) ; off-sheet SPI1_MOSI
SPI1_SCK: U7.C6(PB3) ; off-sheet SPI1_SCK
SPI2_MISO: U7.T15(PB15) ; off-sheet SPI2_MISO
SPI2_MOSI: U7.C14(PI3) ; off-sheet SPI2_MOSI
SPI2_SCK: U7.A15(PI1) ; off-sheet SPI2_SCK
SPI3_MISO: U7.B13(PC11) ; off-sheet SPI3_MISO
SPI3_MOSI: U7.B11(PD6) ; off-sheet SPI3_MOSI
SPI3_SCK: U7.A13(PC10) ; off-sheet SPI3_SCK
SPI4_MISO: U7.D1(PE5) ; off-sheet SPI4_MISO
SPI4_MOSI: U7.E5(PE6) ; off-sheet SPI4_MOSI
SPI4_SCK: U7.C3(PE2) ; off-sheet SPI4_SCK
SPI5_MISO: U7.K4(PF8) ; off-sheet SPI5_MISO
SPI5_MOSI: U7.L4(PF9) ; off-sheet SPI5_MOSI
SPI5_NSS: U7.J15(PK1) ; off-sheet SPI5_NSS
SPI5_SCK: U7.J14(PK0) ; off-sheet SPI5_SCK
SPI6_MISO: U7.C9(PG12) ; off-sheet SPI6_MISO
STM32_CORE_16M: U7.J2(PH0-OSC_IN) ; off-sheet STM32_CORE_16M
STM_FPGA_SPARE1: U7.H17(PK2) ; off-sheet STM_FPGA_SPARE1
STM_FPGA_SPARE2: U7.B16(PH15) ; off-sheet STM_FPGA_SPARE2
STM_FPGA_SPARE3: U7.B17(PH14) ; off-sheet STM_FPGA_SPARE3
STM_FPGA_SPARE4: U7.H16(PG2) ; off-sheet STM_FPGA_SPARE4
STM_FPGA_SPARE5: U7.T11(PH6) ; off-sheet STM_FPGA_SPARE5
STM_FPGA_SPARE6: U7.U13(PH7) ; off-sheet STM_FPGA_SPARE6
SX1276_DIO0: U7.N14(PJ7) ; off-sheet SX1276_DIO0
SX1276_DIO1: U7.D11(PJ12) ; off-sheet SX1276_DIO1
SX1276_DIO2: U7.E10(PJ13) ; off-sheet SX1276_DIO2
SX1276_DIO3: U7.D10(PJ14) ; off-sheet SX1276_DIO3
SX1276_DIO4: U7.A8(PK5) ; off-sheet SX1276_DIO4
SX1276_DIO5: U7.U15(PB14) ; off-sheet SX1276_DIO5
SX1276_HF_TXRX_CTRL: U7.B8(PK4) ; off-sheet SX1276_HF_TXRX_CTRL
SX1276_HFLF_CTRL: U7.C7(PK6) ; off-sheet SX1276_HFLF_CTRL
SX1276_LF_TXRX_CTRL: U7.C8(PK3) ; off-sheet SX1276_LF_TXRX_CTRL
SX1276_RST: U7.B7(PB4) ; off-sheet SX1276_RST
SX_RST: U7.R12(PJ5) ; off-sheet SX_RST
TIM2_CH1: U7.A14(PA15) ; off-sheet TIM2_CH1
TIM2_CH2: U7.R6(PB2) ; off-sheet TIM2_CH2
TIM2_ETR: U7.N5(PA0) ; off-sheet TIM2_ETR
TIM5_ETR: U7.T13(PH8) ; off-sheet TIM5_ETR
UART4_RX: U7.E2(PI9) ; off-sheet UART4_RX
UART4_TX: U7.D16(PH13) ; off-sheet UART4_TX
USBPROG_D_N: U7.E17(PA11) ; off-sheet USBPROG_D_N
USBPROG_D_P: U7.E16(PA12) ; off-sheet USBPROG_D_P
NetD2_1: D2.1(C) R160.2
NetP5_3: P5.3 R40.2
NetQ5_3: Q5.3(D) R160.1

Not connected (* = marked no-connect by the designer): U7 D2(PE4) D4(PB9) D12(PD2) E4(PI8) E14(PC9) J1(PH1-OSC_OUT) T1(PA0_C)

### Layout directives
differential pair: USBPROG_D_N, USBPROG_D_P

### Library data of the parts
D2 = CMP-22017-000005-2: LED GREEN CLEAR CHIP SMD; Dominant Wavelength: 569nm; Reverse Voltage: 5V; Lens Color: Colorless; Viewing Angle: 130°; Voltage: 2V; Forward Current: 30mA; Power Dissipation: 100mW; Luminous Intensity: 6mcd; Number of LEDs: 1; Forward Voltage: 2.1V; Wavelength: 565nm; Test Current: 10mA; Min Operating Temperature: -55°C; Lens Style: Clear; Mount: Surface Mount; Width: 0.8mm; Packaging: Tape and Reel; Lens Transparency: Clear; Case Code (Metric): 1608; Depth: 0.8mm; Case Code (Imperial): 0603; Case/Package: 0603; Number of Pins: 2; Max Operating Temperature: 85°C; Lead Free: Lead Free; Number of Elements: 1; Length: 1.6mm; Height: 0.8mm; Package Quantity: 1; Power Rating: 100mW; Radiation Hardening: No; Illumination Color: Green; Color: Green
P5 = CMP-2000-05153-1: Ultra Small Coaxial Connector, 6 GHz, -40 to 90 degC, 3-Pin SMD, RoHS, Bulk; Manufacturer: Hirose Electric; Connector Style: U.FL; Impedance: 50Ohm; Dielectric Material: LiquidCrystalPolymer(LCP); Minimum Quantity: UltraMiniatureCoaxial; Online Catalog: U.FLSeries; Featured Product: HiroseU.FLSeries; Frequency - Max: 6GHz; Other Names: H122041 / U.FL-R-SMT-1(01)-ND; Contact Termination: Solder; Body Material: PhosphorBronze; Connector Type: Jack,MalePin; Body Finish: Silver; Center Contact Plating: Gold; Manufacturer URL: https://www.hirose.com; Family: CoaxialConnectors(RF); Fastening Type: Snap-On; Unit PriceUSD: U.FL; Series: U.FL; Package Reference: U.FL-R-SMT; Packaging: Bulk; Standard Package: 100; Mounting Type: SurfaceMount; Quantity Available: Bulk; Housing Color: Silver; Package Description: 3-Pin Surface Mount Device, Body 2.6 x 2.6 mm; Category: Connectors,Interconnects; Operating Temperature: -40degC~90degC; Center Contact Material: PhosphorBronze; Dynamic Catalog: U.FLSeries; Datasheet URL: https://datasheet.ciiva.com/26945/getdatasheetpartid-475239-26945414.pdf; Datasheet Version: Feb-09; Shield Termination: Solder
Q5 = CMP-1058-00779-1: Power MOSFET, 30 V, 2.1 A, Single N-Channel, 3-Pin SOT-23, Pb-Free, Tape and Reel; Manufacturer: On Semiconductor; V(BR)DSS Min (V): 30; VGS(th) Max (V): 2.4; Ciss Typ (pF): 140; VGS Max (V): 20; Channel Polarity: N Channel; ID Max (A): 2.1; Coss Typ (pF): 100; Crss Typ (pF): 40; ComponentLink3URL: http://www.onsemi.cn/pub_link/Collateral/318-08.PDF; Configuration: Single; PackageDescription: 3-Pin Small Outline Transistor, Body 2.92 x 1.3 mm, Pitch 0.95 mm; Packing: Tape and Reel; PartNumber: MVGSF1N03LT1G; ComponentLink2URL: http://www.onsemi.cn/pub_link/Collateral/MGSF1N03LT1-D.PDF; PackageVersion: Rev. AP, 11/2009; ComponentLink3Description: Package Specification; Package Type: SOT-23-3; ComponentLink1Description: Manufacturer URL; DatasheetVersion: Rev. 10; PackageReference: SOT-23-3-318-08; ComponentLink2Description: Datasheet; ComponentLink1URL: http://www.onsemi.com/; RoHS: Pb-Free; Mounting Technology: Surface Mount
R20 = CMP-2002-07852-1: as R60 on sheet 06-SX1276
R40 R42 = CMP-2002-06457-1: as R23 on sheet 06-SX1276
R160 = CMP-2002-05853-1: Manufacturer: Panasonic; Part Number: ERA-2AED331X
U7 = CMP-12105-000055-1: HIGH-PERFORMANCE AND DSP WITH DP; Manufacturer: STMicroelectronics; Number Of Uart Channels: 9; Number Of Pwm Channels: 2; Memory Size: 2MBytes; Number Of Ethernet Channels: 1; Ram Size: 1MBytes; Number Of Timers/Counters: 22; Data Bus Width: 32bits; Core Architecture: ARM Cortex-M4, ARM Cortex-M7; Interface: I2C,SPI,UART,USART,CAN,USB,LIN,IrDA,Ethernet,I2S,SMBus,Other; Number Of Adc Channels: 36; Min Supply Voltage: 1.2V; Number Of A/D Converters: 3; Number Of Spi Channels: 6; Max Supply Voltage: 3.6V; Frequency: 480MHz; Memory Type: FLASH; Number Of I2C Channels: 4; Max Junction Temp: +125°C; Standoff Height: 0.15mm; Number Of I/Os: 168; Device Class L2: Embedded Processors and Controllers; Digikey Description: HIGH-PERFORMANCE AND DSP WITH DP; RoHS: TRUE; Lead Free: Yes; Manufacturer Part Number: STM32H747XIH6; ComponentLink2URL: https://www.st.com/resource/en/datasheet/stm32h747xi.pdf; Mouser Description: STM32 Series 2 MB Flash 1 MB RAM 480 MHz 32-Bit Microcontroller - TFBGA-265; Device Class L1: Integrated Circuits (ICs); Ipc Land Pattern Name: BGA289N80P17X17_1400X1400X110; Category: IC; Device Class L3: Microcontrollers; Ambient Temperature Range High: +85°C; Number Of Cores: 2; Temperature Range High: +125°C; ComponentLink2Description: Datasheet; Automotive: No; Ambient Temperature Range Low: -40°C; Package: TFBGA240+25-A07U; Temperature: -40°C to +125°C; Number Of Usb Channels: 2; Temperature Range Low: -40°C; Height: 1.1mm; Octopart: https://octopart.com/stm32h747xih6-stmicroelectronics-100293943

## Sheet 10-USB-Prog.SchDoc
size B; SheetNumber: 10; SheetTotal: 19
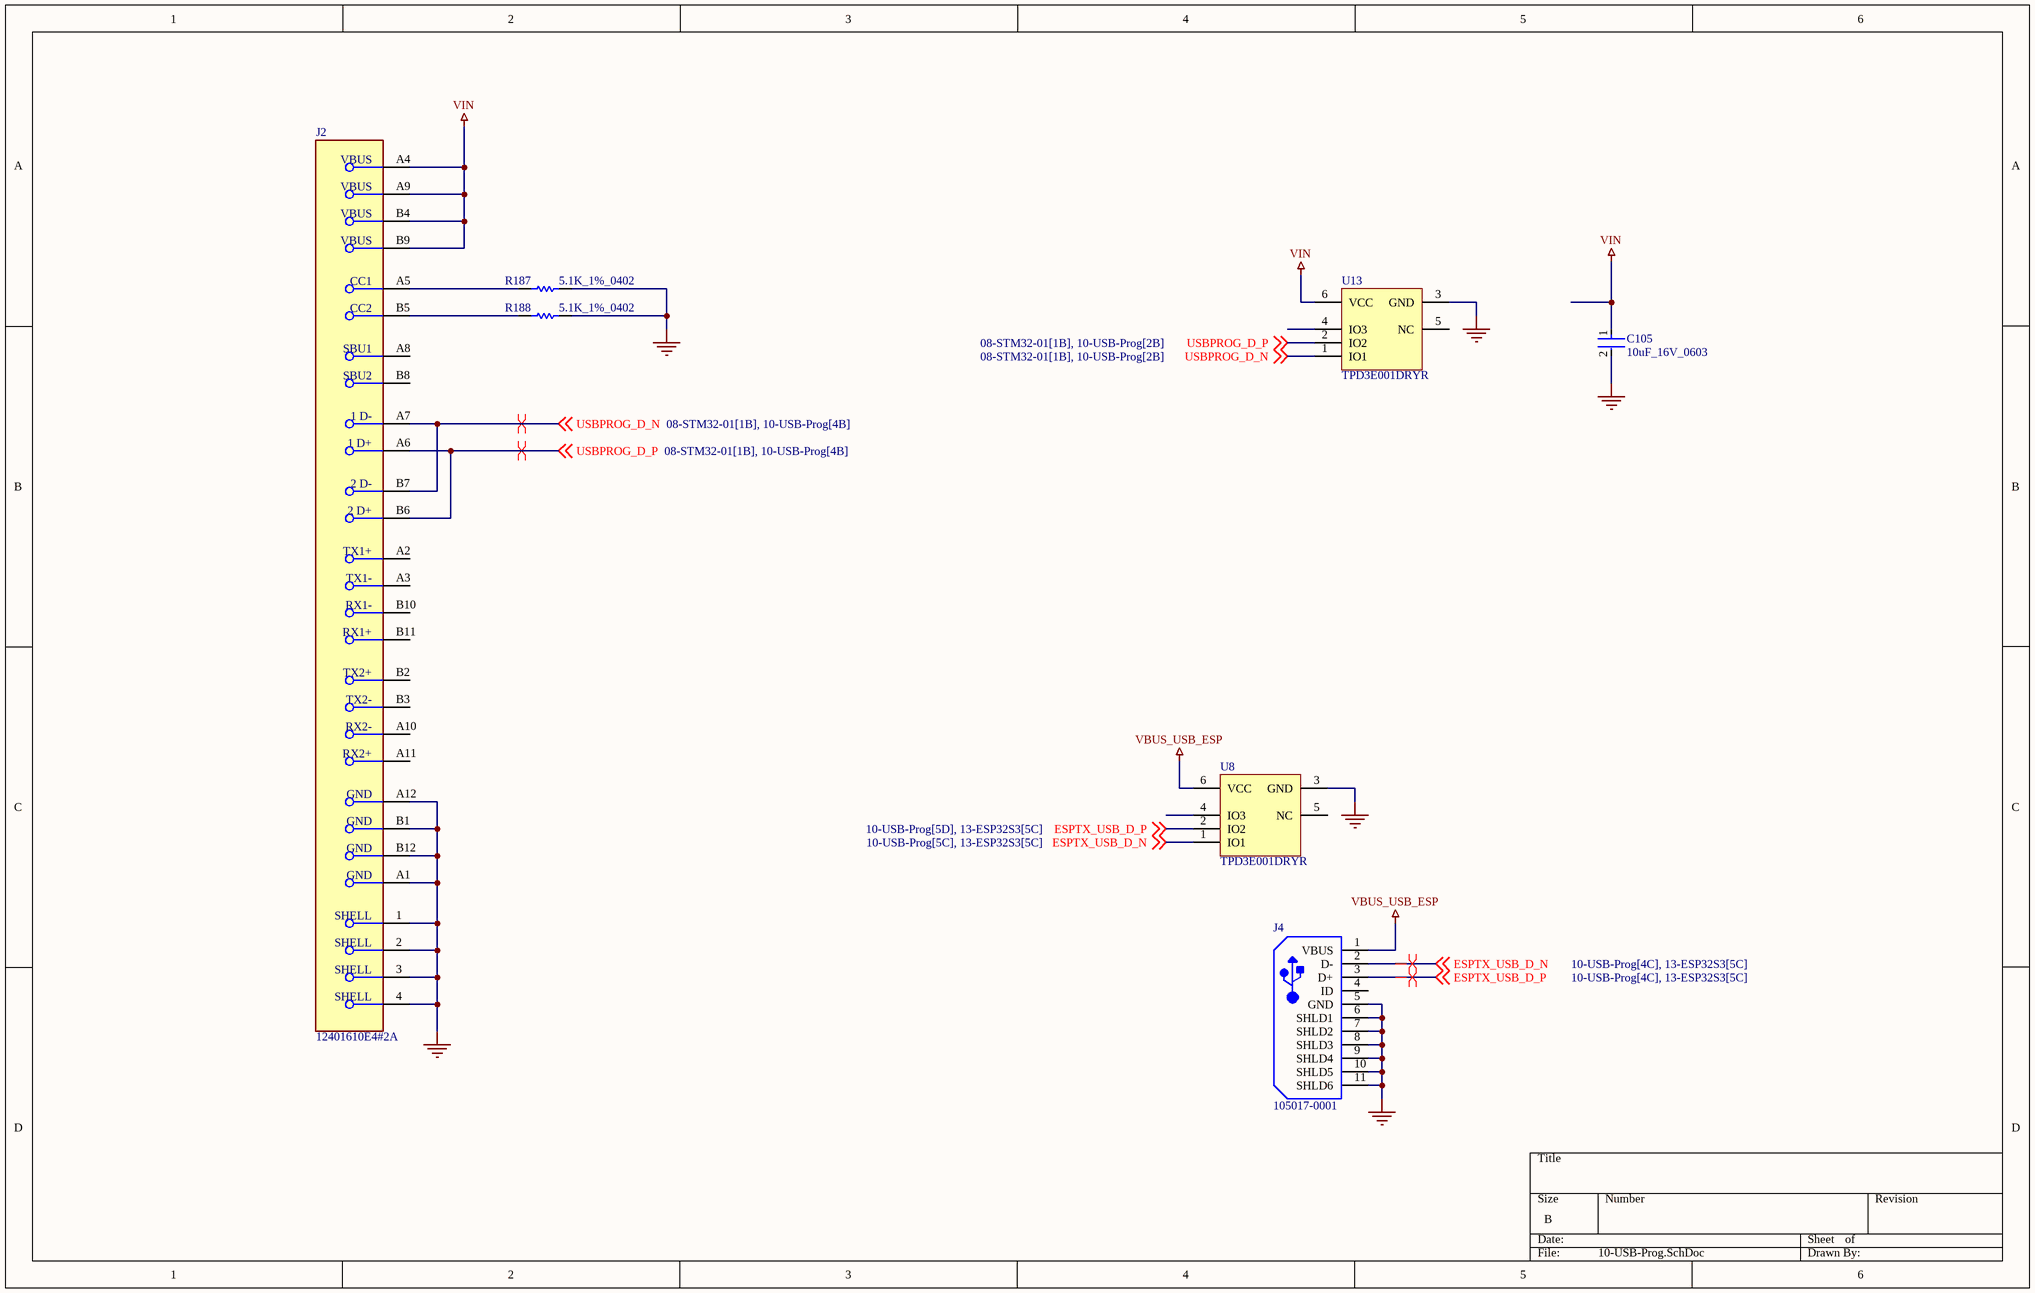
[diagram p7: 10-USB-Prog.SchDoc]

### Parts
C105  10uF_16V_0603  [FP-0603-L_1_6_0_2-W_0_8_0-MFG]
J2  12401610E4#2A  [FP-12401610E4#2A-MFG]
J4  105017-0001  [USB-MICRO-B_V]
R187  5.1K_1%_0402  [RESC1005X40X25NL05T10]
R188  5.1K_1%_0402  [RESC1005X40X25NL05T10]
U8  TPD3E001DRYR  [DRY0006A]
U13  TPD3E001DRYR  [DRY0006A]

### Nets
GND: C105.2 J2.1(SHELL) J2.2(SHELL) J2.3(SHELL) J2.4(SHELL) J2.A1(GND) J2.A12(GND) J2.B1(GND) J2.B12(GND) J4.5(GND) J4.6(SHLD1) J4.7(SHLD2) J4.8(SHLD3) J4.9(SHLD4) J4.10(SHLD5) J4.11(SHLD6) R187.2 R188.2 U8.3(GND) U13.3(GND)
VBUS_USB_ESP: J4.1(VBUS) U8.6(VCC)
VIN: C105.1 J2.A4(VBUS) J2.A9(VBUS) J2.B4(VBUS) J2.B9(VBUS) U13.6(VCC)
ESPTX_USB_D_N: J4.2(D-) U8.1(IO1) ; off-sheet ESPTX_USB_D_N
ESPTX_USB_D_P: J4.3(D+) U8.2(IO2) ; off-sheet ESPTX_USB_D_P
USBPROG_D_N: J2.A7(1_D-) J2.B7(2_D-) U13.1(IO1) ; off-sheet USBPROG_D_N
USBPROG_D_P: J2.A6(1_D+) J2.B6(2_D+) U13.2(IO2) ; off-sheet USBPROG_D_P
NetJ2_A5: J2.A5(CC1) R187.1
NetJ2_B5: J2.B5(CC2) R188.1

Not connected (* = marked no-connect by the designer): J2 A2(TX1+) A3(TX1-) A8(SBU1) A10(RX2-) A11(RX2+) B2(TX2+) B3(TX2-) B8(SBU2) B10(RX1-) B11(RX1+); J4 4(ID); U8 4(IO3) 5(NC); U13 4(IO3) 5(NC)

### Layout directives
differential pair: ESPTX_USB_D_N, ESPTX_USB_D_P, USBPROG_D_N, USBPROG_D_P

### Library data of the parts
C105 = CMP-2000-06226-4: Multilayer Ceramic Capacitor 10uF 16V X5R 20% SMD 0603 T/R; Packaging: Tape and Reel; Construction: Flat; Height: 0.8mm; Max Operating Temperature: 85°C; Dielectric: X5R; Case Code (Metric): 1608; Voltage Rating (DC): 16V; Width: 0.031inch; Voltage Rating: 16V; Length: 0.063inch; RoHS Compliant: Yes; Halogen Free: Halogen Free; Case Code (Imperial): 0603; Capacitance: 10uF; Mount: Surface Mount; Thickness: 0.031inch; Tolerance: 20%; Min Operating Temperature: -55°C; Series: M; Termination: SMD/SMT; Case/Package: 0603; Package Quantity: 1
J2 = CMP-02355-000003-1: CONN RCP USB3.1 TYPEC 24P SMD RA; Connector Type: USB; Number of Contacts: 24; Gender: Receptacle; Packaging: Cut Tape; Mount: Surface Mount; Number of Pins: 24
J4 = CMP-2000-05827-1: Micro-USB B Receptacle, Right Angle, Bottom Mount, Surface Mount, with Solder Tabs, -30 to 85 degC, 5-Pin USB, RoHS, Tape and Reel; Manufacturer: Molex; Featured Product: Micro-USBConnectorsUSBConnectors; Other Names: WM1399DKR; Package Version: Rev. F, 12/2012; Number of Contacts: 5; Connector Type: USB-microB; Catalog Drawings: 1050170001; 3D Model: 105017-0001.stp; Mating Products: WM17145-ND-CABLEMICROUSBBTOSTDA1.0MWM17147-ND-CABLEMICROUSBBTOSTDA2.0MWM17146-ND-CABLEMICROUSBBTOSTDA1.5M; PCN Assembly/Origin: ResinSupplier21/Oct/2015; Voltage - Max: 30V; Online Catalog: Molex-MicroUSB; Manufacturer URL: http://www.molex.com/; Package Description: 5-Leads USB, Micro B, Body 7.5 x 5 mm, Pitch 0.65 mm; Datasheet URL: http://www.molex.com/elqNow/elqRedir.htm?ref=http://www.molex.com/webdocs/datasheets/pdf/en-us/1050170001_IO_CONNECTORS.pdf; Ingress Protection: -; Datasheet Version: 03/2016; Mounting Type: BoardCutout,SurfaceMount,RightAngle; Circuits: 5; Standard Package: 1; Package Reference: MICRO-B; Package URL: http://www.molex.com/pdm_docs/sd/1050170001_sd.pdf; Category: Connectors,Interconnects; Series: -; RoHS Information: 1050170001CertofCompliance; Features: Shielded,SolderRetention; Family: USB,DVI,HDMIConnectors; Specifications: -; Gender: Receptacle; Packaging: Digi-Reel®; Mounting Technology: SurfaceMount
R187 R188 = CMP-2002-07753-1: Part Number: RC0402FR-075K1L; Manufacturer: Yageo / Phycomp
U8 U13 = CMP-0326-00032-3: Low-Capacitance + / - 15 kV ESD-Protection Array for High-Speed Data Interfaces, 3 Channels, -40 to +85 degC, 6-pin SON (DRY), Green (RoHS & no Sb/Br); Manufacturer: Texas Instruments; USB High Speed: TRUE; SubFamily: ESD Solution; IO Capacitance(Typ)(pF): 1.5; IEC 61000-4-2 Contact(+/- kV): 8; IO Leakage Current(nA): Jan-00; Breakdown Voltage(Min)(V): 11; IEC 61000-4-2 Air-Gap(+/- kV): 15; DatasheetVersion: SLLS683D; Mounting Technology: Surface Mount; ComponentLink1URL: http://www.ti.com/; PackageReference: DRY0006A; ComponentLink2URL: http://www.ti.com/general/docs/lit/getliterature.tsp?genericPartNumber=TPD3E001&fileType=pdf; ComponentLink2Description: Datasheet; ComponentLink3Description: URL Link1; PackageDescription: 6-Pin Plastic Small Outline No-Lead, 1 x 1.45 x 0.6 mm Body, 0.5 mm Pitch; ComponentLink1Description: Manufacturer URL; PackageVersion: revF, Dec-2011; PartNumber: TPD3E001DRYR; Eco-Plan: Green (RoHS & no Sb/Br); ComponentLink3URL: SamplesURL:http://www.ti.com/product/tpd3e001#samples